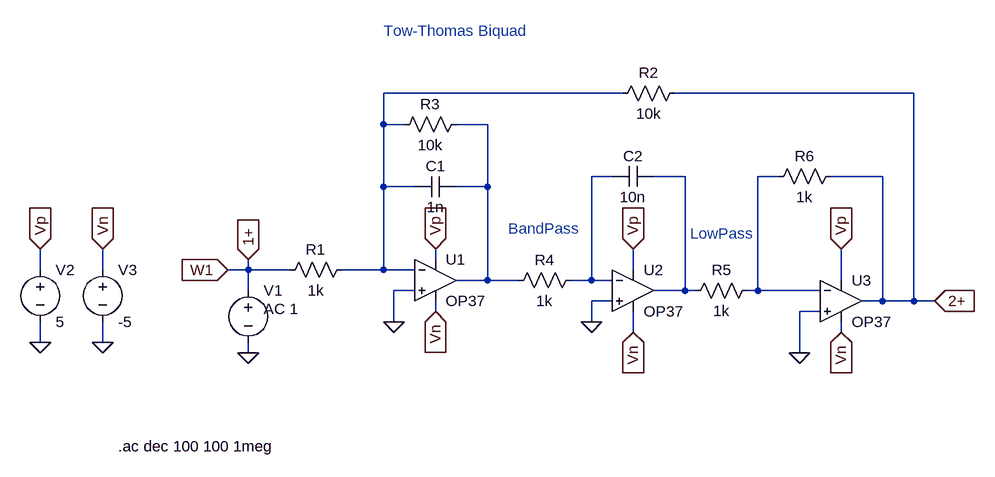
[diagram p0: schematic tt_biquad.asc]
tt_biquad.asc, the LTspice schematic file:
Version 4
SHEET 1 1384 680
WIRE 688 -176 320 -176
WIRE 1136 -176 768 -176
WIRE 320 -128 320 -176
WIRE 352 -128 320 -128
WIRE 480 -128 432 -128
WIRE 672 -48 640 -48
WIRE 784 -48 736 -48
WIRE 928 -48 896 -48
WIRE 1088 -48 1008 -48
WIRE 320 -32 320 -128
WIRE 368 -32 320 -32
WIRE 480 -32 480 -128
WIRE 480 -32 432 -32
WIRE 400 80 400 64
WIRE -208 96 -208 64
WIRE -112 96 -112 64
WIRE 112 96 112 80
WIRE 112 96 80 96
WIRE 176 96 112 96
WIRE 320 96 320 -32
WIRE 320 96 256 96
WIRE 368 96 320 96
WIRE 704 96 704 64
WIRE 480 112 480 -32
WIRE 480 112 432 112
WIRE 528 112 480 112
WIRE 640 112 640 -48
WIRE 640 112 608 112
WIRE 672 112 640 112
WIRE 1024 112 1024 64
WIRE 112 128 112 96
WIRE 368 128 336 128
WIRE 784 128 784 -48
WIRE 784 128 736 128
WIRE 800 128 784 128
WIRE 896 128 896 -48
WIRE 896 128 880 128
WIRE 992 128 896 128
WIRE 672 144 640 144
WIRE 1088 144 1088 -48
WIRE 1088 144 1056 144
WIRE 1136 144 1136 -176
WIRE 1136 144 1088 144
WIRE 1168 144 1136 144
WIRE 400 160 400 144
WIRE 992 160 960 160
WIRE 336 176 336 128
WIRE 640 176 640 144
WIRE 704 192 704 160
WIRE 1024 192 1024 176
WIRE -208 208 -208 176
WIRE -112 208 -112 176
WIRE 112 224 112 208
WIRE 960 224 960 160
FLAG 400 64 Vp
IOPIN 400 64 In
FLAG 400 160 Vn
IOPIN 400 160 In
FLAG 1168 144 2+
IOPIN 1168 144 In
FLAG 112 224 0
FLAG 80 96 W1
IOPIN 80 96 In
FLAG 112 80 1+
IOPIN 112 80 In
FLAG -208 208 0
FLAG -112 208 0
FLAG -208 64 Vp
IOPIN -208 64 In
FLAG -112 64 Vn
IOPIN -112 64 In
FLAG 336 176 0
FLAG 640 176 0
FLAG 704 64 Vp
IOPIN 704 64 In
FLAG 704 192 Vn
IOPIN 704 192 In
FLAG 960 224 0
FLAG 1024 64 Vp
IOPIN 1024 64 In
FLAG 1024 192 Vn
IOPIN 1024 192 In
SYMBOL Opamps\\OP37 400 48 R0
SYMATTR InstName U1
SYMBOL voltage 112 112 R0
WINDOW 123 24 44 Left 2
WINDOW 39 0 0 Left 0
SYMATTR Value2 AC 1
SYMATTR InstName V1
SYMATTR Value ""
SYMBOL voltage -208 80 R0
WINDOW 123 0 0 Left 0
WINDOW 39 0 0 Left 0
SYMATTR InstName V2
SYMATTR Value 5
SYMBOL voltage -112 80 R0
WINDOW 123 0 0 Left 0
WINDOW 39 0 0 Left 0
SYMATTR InstName V3
SYMATTR Value -5
SYMBOL res 272 80 R90
WINDOW 0 0 56 VBottom 2
WINDOW 3 32 56 VTop 2
SYMATTR InstName R1
SYMATTR Value 1k
SYMBOL res 448 -144 R90
WINDOW 0 0 56 VBottom 2
WINDOW 3 32 56 VTop 2
SYMATTR InstName R3
SYMATTR Value 10k
SYMBOL cap 432 -48 R90
WINDOW 0 0 32 VBottom 2
WINDOW 3 32 32 VTop 2
SYMATTR InstName C1
SYMATTR Value 1n
SYMBOL res 784 -192 R90
WINDOW 0 0 56 VBottom 2
WINDOW 3 32 56 VTop 2
SYMATTR InstName R2
SYMATTR Value 10k
SYMBOL Opamps\\OP37 704 64 R0
SYMATTR InstName U2
SYMBOL res 624 96 R90
WINDOW 0 0 56 VBottom 2
WINDOW 3 32 56 VTop 2
SYMATTR InstName R4
SYMATTR Value 1k
SYMBOL cap 736 -64 R90
WINDOW 0 0 32 VBottom 2
WINDOW 3 32 32 VTop 2
SYMATTR InstName C2
SYMATTR Value 10n
SYMBOL res 896 112 R90
WINDOW 0 0 56 VBottom 2
WINDOW 3 32 56 VTop 2
SYMATTR InstName R5
SYMATTR Value 1k
SYMBOL res 1024 -64 R90
WINDOW 0 0 56 VBottom 2
WINDOW 3 32 56 VTop 2
SYMATTR InstName R6
SYMATTR Value 1k
SYMBOL Opamps\\OP37 1024 80 R0
SYMATTR InstName U3
TEXT -88 368 Left 2 !.ac dec 100 100 1meg
TEXT 320 -272 Left 2 ;Tow-Thomas Biquad
TEXT 512 32 Left 2 ;BandPass
TEXT 792 40 Left 2 ;LowPass

The netlist it stands for:
* tt_biquad.asc
XU1 0 N001 Vp Vn N002 LT1037  ; OP37, pins In+ In- V+ V- OUT
V1 1+ 0 AC 1
V2 Vp 0 5
V3 Vn 0 -5
R1 N001 1+ 1k
R3 N002 N001 10k
C1 N002 N001 1n
R2 2+ N001 10k
XU2 0 N003 Vp Vn N004 LT1037  ; OP37, pins In+ In- V+ V- OUT
R4 N003 N002 1k
C2 N004 N003 10n
R5 N005 N004 1k
R6 2+ N005 1k
XU3 0 N005 Vp Vn 2+ LT1037  ; OP37, pins In+ In- V+ V- OUT
.ac dec 100 100 1meg
* Tow-Thomas Biquad
* BandPass
* LowPass
.lib LTC.lib
.backanno
.end